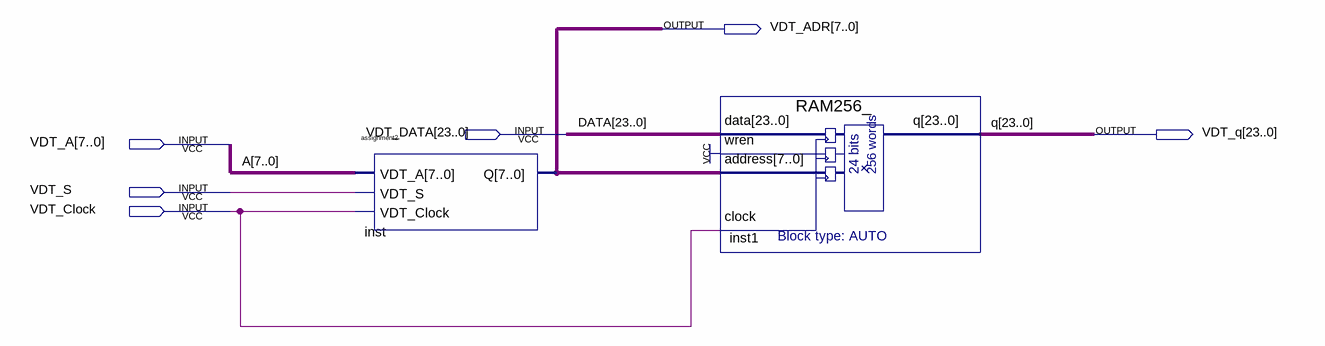
[diagram p0: schematic sheet]
// Quartus schematic assignment3_lab6.bdf as structural Verilog: 2 symbols, 6 pins
module assignment3_lab6 (
  input  [23:0] VDT_DATA,
  input  [7:0] VDT_A,
  input  VDT_S,
  input  VDT_Clock,
  output [7:0] VDT_ADR,
  output [23:0] VDT_q
);

  assignment2 inst (.VDT_A(VDT_A), .VDT_S(VDT_S), .VDT_Clock(VDT_Clock), .Q(VDT_ADR));
  RAM256_ inst1 (.data(VDT_DATA), .wren(1'b1), .address(VDT_ADR), .clock(VDT_Clock), .q(VDT_q));

  // Other names for the same wires on the sheet: A[7:0] = VDT_A; DATA[23:0] = VDT_DATA; q[23:0] = VDT_q
endmodule
